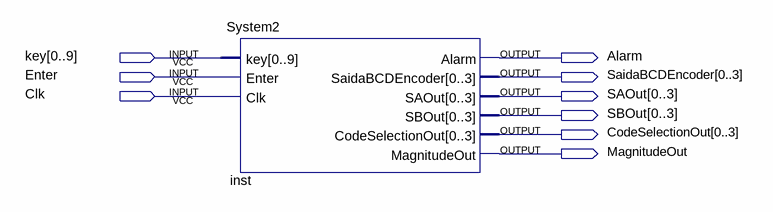
[diagram p0: schematic sheet]
// Quartus schematic testes2.bdf as structural Verilog: 1 symbols, 9 pins
module testes2 (
  input  [0:9] key,
  input  Enter,
  input  Clk,
  output Alarm,
  output [0:3] SaidaBCDEncoder,
  output [0:3] SAOut,
  output [0:3] SBOut,
  output [0:3] CodeSelectionOut,
  output MagnitudeOut
);

  System2 inst (
    .key(key), .Enter(Enter), .Clk(Clk), .Alarm(Alarm), .SaidaBCDEncoder(SaidaBCDEncoder), .SAOut(SAOut),
    .SBOut(SBOut), .CodeSelectionOut(CodeSelectionOut), .MagnitudeOut(MagnitudeOut));
endmodule
